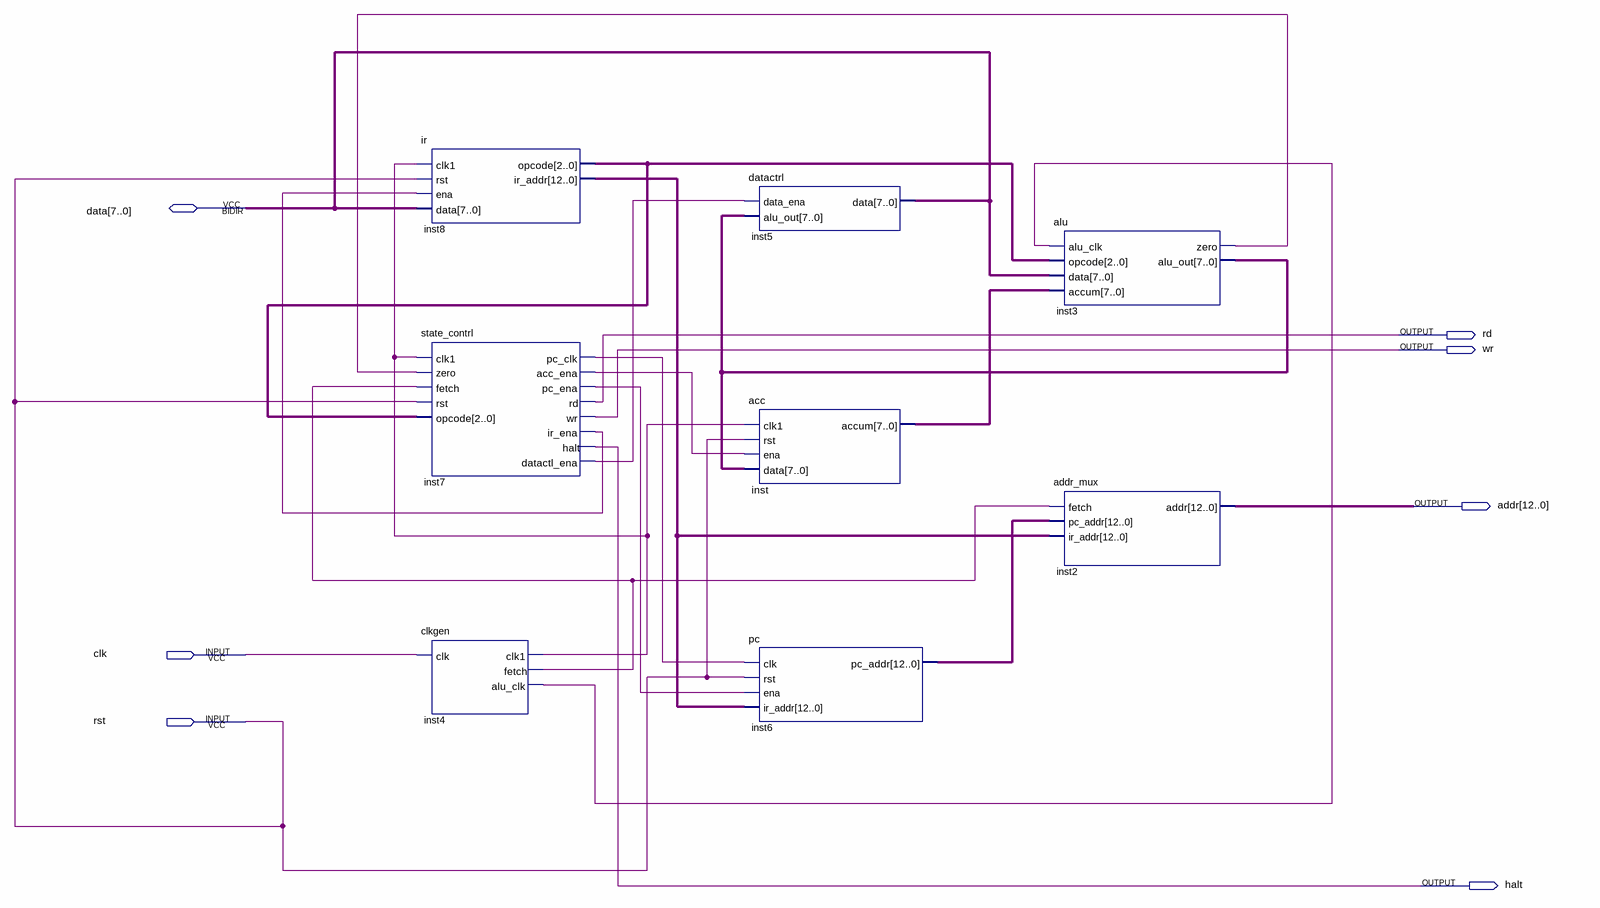
[diagram p0: schematic sheet]
// Quartus schematic CPU.bdf as structural Verilog: 8 symbols, 7 pins
module CPU (
  input  clk,
  input  rst,
  inout  [7:0] data,
  output rd,
  output wr,
  output [12:0] addr,
  output halt
);

  wire inst3_zero, inst4_alu_clk, inst4_clk1, inst4_fetch, inst7_acc_ena, inst7_datactl_ena, inst7_ir_ena,
       inst7_pc_clk, inst7_pc_ena;
  wire [2:0] inst8_opcode;
  wire [7:0] inst3_alu_out, inst_accum;
  wire [12:0] inst6_pc_addr, inst8_ir_addr;

  ir inst8 (
    .clk1(inst4_clk1), .rst(rst), .ena(inst7_ir_ena), .data(data), .opcode(inst8_opcode),
    .ir_addr(inst8_ir_addr));
  state_contrl inst7 (
    .clk1(inst4_clk1), .zero(inst3_zero), .fetch(inst4_fetch), .rst(rst), .opcode(inst8_opcode),
    .pc_clk(inst7_pc_clk), .acc_ena(inst7_acc_ena), .pc_ena(inst7_pc_ena), .rd(rd), .wr(wr),
    .ir_ena(inst7_ir_ena), .halt(halt), .datactl_ena(inst7_datactl_ena));
  clkgen inst4 (.clk(clk), .clk1(inst4_clk1), .fetch(inst4_fetch), .alu_clk(inst4_alu_clk));
  datactrl inst5 (.data_ena(inst7_datactl_ena), .alu_out(inst3_alu_out), .data(data));
  acc inst (.clk1(inst4_clk1), .rst(rst), .ena(inst7_acc_ena), .data(inst3_alu_out), .accum(inst_accum));
  pc inst6 (.clk(inst7_pc_clk), .rst(rst), .ena(inst7_pc_ena), .ir_addr(inst8_ir_addr), .pc_addr(inst6_pc_addr));
  alu inst3 (
    .alu_clk(inst4_alu_clk), .opcode(inst8_opcode), .data(data), .accum(inst_accum), .zero(inst3_zero),
    .alu_out(inst3_alu_out));
  addr_mux inst2 (.fetch(inst4_fetch), .pc_addr(inst6_pc_addr), .ir_addr(inst8_ir_addr), .addr(addr));
endmodule
